# EAGLE design hitchBOT-on-a-board (EAGLE 6.5.0)
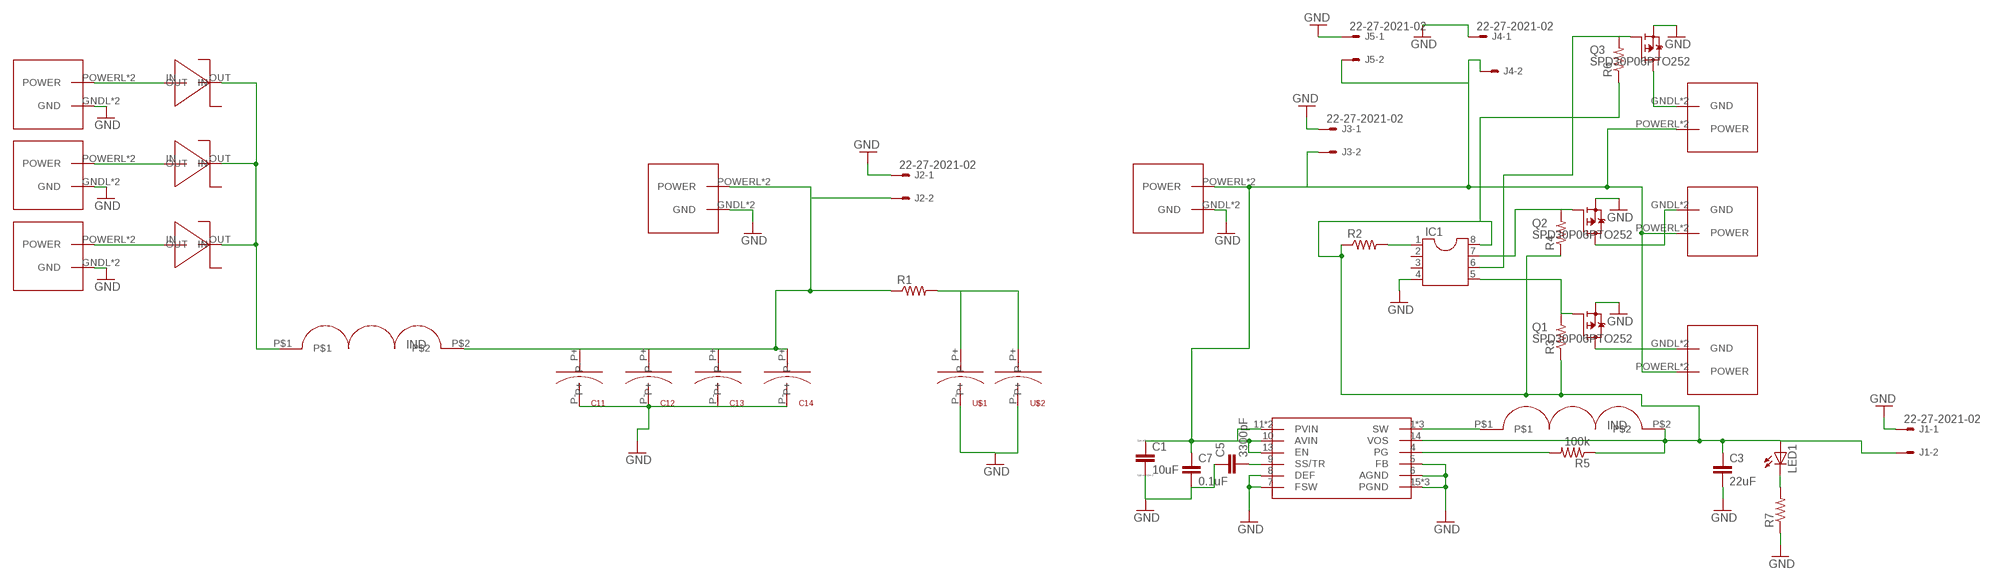
[diagram p0: schematic, sheet 1]

## Parts
C1  10uF  CC1210  [C1210]
C3  22uF  C-EUC0805  [C0805]
C5  3300pF  C-EUC0603  [C0603]
C7  0.1uF  C-EUC0603  [C0603]
C11  SMD-CAP-NICHICON-8MM  [SMD-CAP-8MM]
C12  SMD-CAP-NICHICON-8MM  [SMD-CAP-8MM]
C13  SMD-CAP-NICHICON-8MM  [SMD-CAP-8MM]
C14  SMD-CAP-NICHICON-8MM  [SMD-CAP-8MM]
IC1  DIL8S  [SOCKET-08]
J1  22-27-2021-02  [6410-02]
J2  22-27-2021-02  [6410-02]
J3  22-27-2021-02  [6410-02]
J4  22-27-2021-02  [6410-02]
J5  22-27-2021-02  [6410-02]
LED1  LEDCHIPLED_1206  [CHIPLED_1206]
Q1  SPD30P06PTO252  [TO252]
Q2  SPD30P06PTO252  [TO252]
Q3  SPD30P06PTO252  [TO252]
R1  R-US_R1206  [R1206]
R2  R-US_R1206  [R1206]
R3  R-US_R1206  [R1206]
R4  R-US_R1206  [R1206]
R5  100k  R-US_R1206  [R1206]
R6  R-US_R1206  [R1206]
R7  R-US_R1206  [R1206]
U$1  SMD-CAP-PANASONIC-E-FT-10MM  [SMD-CAP-10MM]
U$2  SMD-CAP-PANASONIC-E-FT-10MM  [SMD-CAP-10MM]
U$3  INDUCTOR-M8365  [INDUCTOR-M8365]
U$4  2X2-MOLEX  [2X2MOLEX]
U$5  2X2-MOLEX  [2X2MOLEX]
U$6  2X2-MOLEX  [2X2MOLEX]
U$7  DO-214AB  [DO-214AB]
U$8  DO-214AB  [DO-214AB]
U$9  DO-214AB  [DO-214AB]
U$10  2X2-MOLEX  [2X2MOLEX]
U$11  2X2-MOLEX  [2X2MOLEX]
U$12  2X2-MOLEX  [2X2MOLEX]
U$13  2X2-MOLEX  [2X2MOLEX]
U$14  TPS62133  [QFN16]
U$15  DR73-2R2-R  [DR73-2R2-R]
U$17  2X2-MOLEX  [2X2MOLEX]

## Nets
GND: C1.2 C3.2 C5.1 C7.2 C11.P- C12.P- C13.P- C14.P- IC1.4 J1.1 J2.1 J3.1 J4.1 J5.1 Q1.2(S) Q2.2(S) Q3.2(S) R7.1 U$1.P- U$2.P- U$4.GNDL(GND) U$4.GNDR(GND) U$5.GNDL(GND) U$5.GNDR(GND) U$6.GNDL(GND) U$6.GNDR(GND) U$10.GNDL(GND) U$10.GNDR(GND) U$11.GNDL(GND) U$11.GNDR(GND) U$14.5(FB) U$14.6(AGND) U$14.7(FSW) U$14.8(DEF) U$14.15(PGND) U$14.16(PGND) U$14.P$1(PGND)
N$1: C11.P+ C12.P+ C13.P+ C14.P+ J2.2 R1.1 U$3.P$2 U$10.POWERL(POWER) U$10.POWERR(POWER)
N$2: R1.2 U$1.P+ U$2.P+
N$3: U$5.POWERL(POWER) U$5.POWERR(POWER) U$7.IN
N$4: U$6.POWERL(POWER) U$6.POWERR(POWER) U$8.IN
N$5: U$4.POWERL(POWER) U$4.POWERR(POWER) U$9.IN
N$6: U$3.P$1 U$7.OUT U$8.OUT U$9.OUT
N$7: IC1.1 R2.2
N$8: C1.1 C7.1 J3.2 J4.2 J5.2 U$11.POWERL(POWER) U$11.POWERR(POWER) U$12.POWERL(POWER) U$12.POWERR(POWER) U$13.POWERL(POWER) U$13.POWERR(POWER) U$14.10(AVIN) U$14.11(PVIN) U$14.12(PVIN) U$14.13(EN) U$17.POWERL(POWER) U$17.POWERR(POWER)
N$9: Q1.3(D) U$13.GNDL(GND) U$13.GNDR(GND)
N$10: Q2.3(D) U$12.GNDL(GND) U$12.GNDR(GND)
N$11: IC1.7 Q2.1(G) R4.2
N$13: IC1.5 Q1.1(G) R3.2
N$14: U$14.1(SW) U$14.2(SW) U$14.3(SW) U$15.P$1
N$15: C3.1 IC1.8 J1.2 LED1.A R2.1 R3.1 R4.1 R5.1 R6.1 U$14.14(VOS) U$15.P$2
N$16: R5.2 U$14.4(PG)
N$17: C5.2 U$14.9(SS/TR)
N$18: Q3.3(D) U$17.GNDL(GND) U$17.GNDR(GND)
N$19: IC1.6 Q3.1(G) R6.2
N$20: LED1.C R7.2
Unconnected: IC1.2 IC1.3

## Library data of the parts
C1 = eagle-ltspice:C: CAPACITOR, European symbol; SPICEMODEL: NONE; SPICEPREFIX: C
C3 C5 C7 = rcl:C-EU: CAPACITOR, European symbol
C11-C14 = macgrid:SMD-CAP-NICHICON-8MM
IC1 = ic-package:DIL8: Dual In Line / Socket
J1-J5 = con-molex:22-?-02: CONNECTOR wire to board 2.54 mm (.1 inch) pitch header; OC_FARNELL: unknown; OC_NEWARK: unknown
LED1 = led:LED: LED OSRAM: - CHIPLED LG R971, LG N971, LY N971, LG Q971, LY Q971, LO R971, LY R971 LH N974, LH R974 LS Q976, LO Q976, LY Q976 LO Q996 - Hyper CHIPLED LW Q18S LB Q993, LB Q99A, LB R99A - SideLED LS A670, LO A670, LY A670, LG A670, LP A670 LB A673, LV A673, LT A673, LW A673 LH A674 LY A675 LS A676, LA A676, LO A676, LY A676, LW A676 LS A679, LY A679, LG A679 - Hyper Micro SIDELED® LS Y876, LA Y876, LO Y876, LY Y876 LT Y87S - SmartLED LW L88C, LW L88S LB L89C, LB L89S, LG L890 LS L89K, LO L89K, LY L89K LS L896, LA L896, LO L896, LY L896 - TOPLED LS T670, LO T670, LY T670, LG T670, LP T670 LSG T670, LSP T670, LSY T670, LOP T670, LYG T670 LG T671, LOG T671, LSG T671 LB T673, LV T673, LT T673, LW T673 LH T674 LS T676, LA T676, LO T676, LY T676, LB T676, LH T676, LSB T676, LW T676 LB T67C, LV T67C, LT T67C, LS T67K, LO T67K, LY T67K, LW E67C LS E67B, LA E67B, LO E67B, LY E67B, LB E67C, LV E67C, LT E67C LW T67C LS T679, LY T679, LG T679 LS T770, LO T770, LY T770, LG T770, LP T770 LB T773, LV T773, LT T773, LW T773 LH T774 LS E675, LA E675, LY E675, LS T675 LS T776, LA T776, LO T776, LY T776, LB T776 LHGB T686 LT T68C, LB T68C - Hyper Mini TOPLED® LB M676 - Mini TOPLED Santana® LG M470 LS M47K, LO M47K, LY M47K Source: http://www.osram.convergy.de LUXEON: - LUMILED® LXK2-PW12-R00, LXK2-PW12-S00, LXK2-PW14-U00, LXK2-PW14-V00 LXK2-PM12-R00, LXK2-PM12-S00, LXK2-PM14-U00 LXK2-PE12-Q00, LXK2-PE12-R00, LXK2-PE12-S00, LXK2-PE14-T00, LXK2-PE14-U00 LXK2-PB12-K00, LXK2-PB12-L00, LXK2-PB12-M00, LXK2-PB14-N00, LXK2-PB14-P00, LXK2-PB14-Q00 LXK2-PR12-L00, LXK2-PR12-M00, LXK2-PR14-Q00, LXK2-PR14-R00 LXK2-PD12-Q00, LXK2-PD12-R00, LXK2-PD12-S00 LXK2-PH12-R00, LXK2-PH12-S00 LXK2-PL12-P00, LXK2-PL12-Q00, LXK2-PL12-R00 Source: www.luxeon.com KINGBRIGHT: KA-3528ASYC Source: www.kingbright.com
Q1-Q3 = transistor-fet:SPD30P06P: SIPMOS(R) Power-Transistor P-Channel, Enhancement mode Source: http://www.infineon.com/upload/Document/cmc_upload/documents/012/3615/SPD_U30P06P.pdf
R1-R6 = resistor:R-US_: RESISTOR, American symbol
R7 = rcl:R-US_: RESISTOR, American symbol
U$1 U$2 = macgrid:SMD-CAP-PANASONIC-E-FT-10MM
U$3 = macgrid:INDUCTOR-M8365
U$4-U$6 U$10-U$13 U$17 = Molex:2X2-MOLEX
U$7-U$9 = macgrid:DO-214AB
U$14 = macgrid:TPS62133
U$15 = macgrid:DR73-2R2-R

## Board
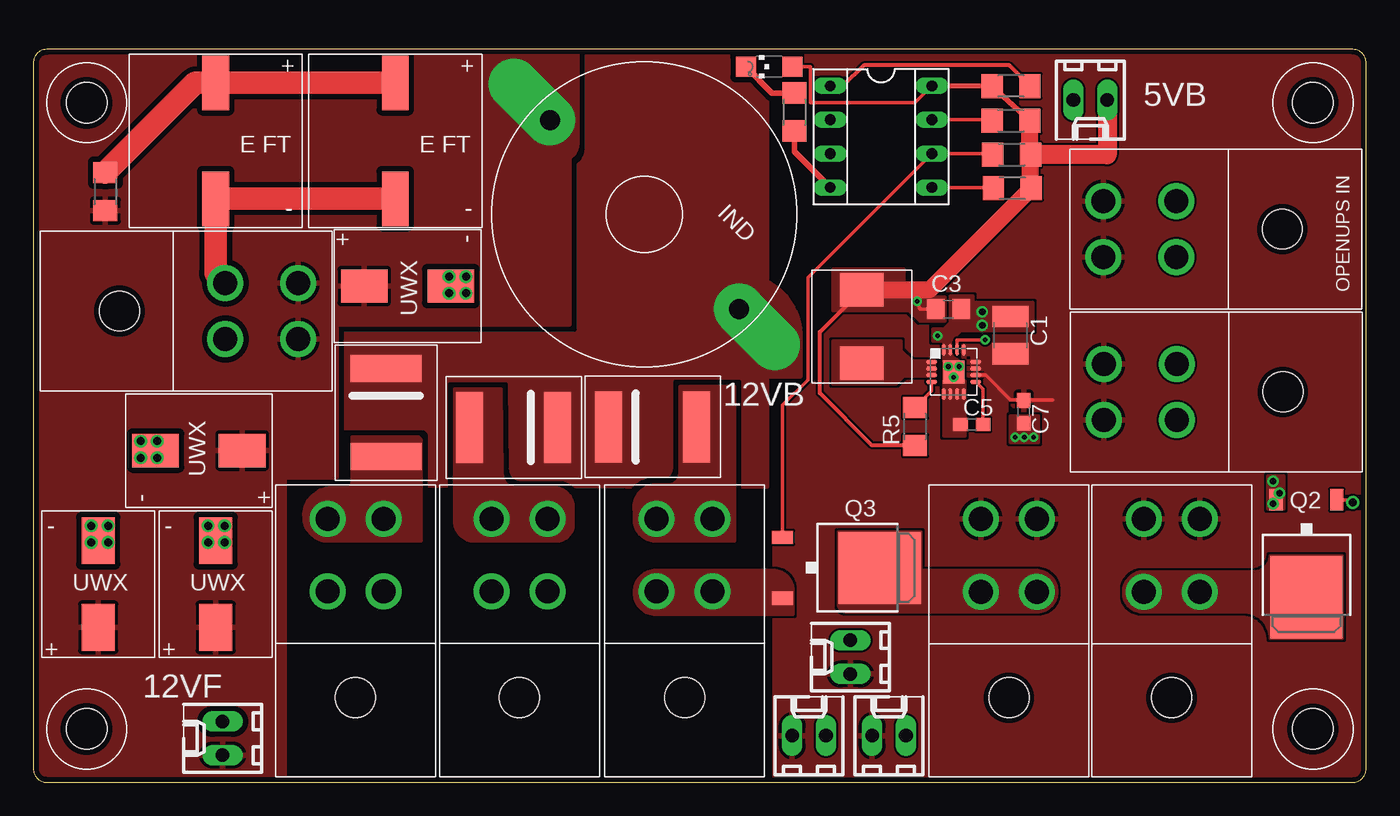
[diagram p1: board, top side]
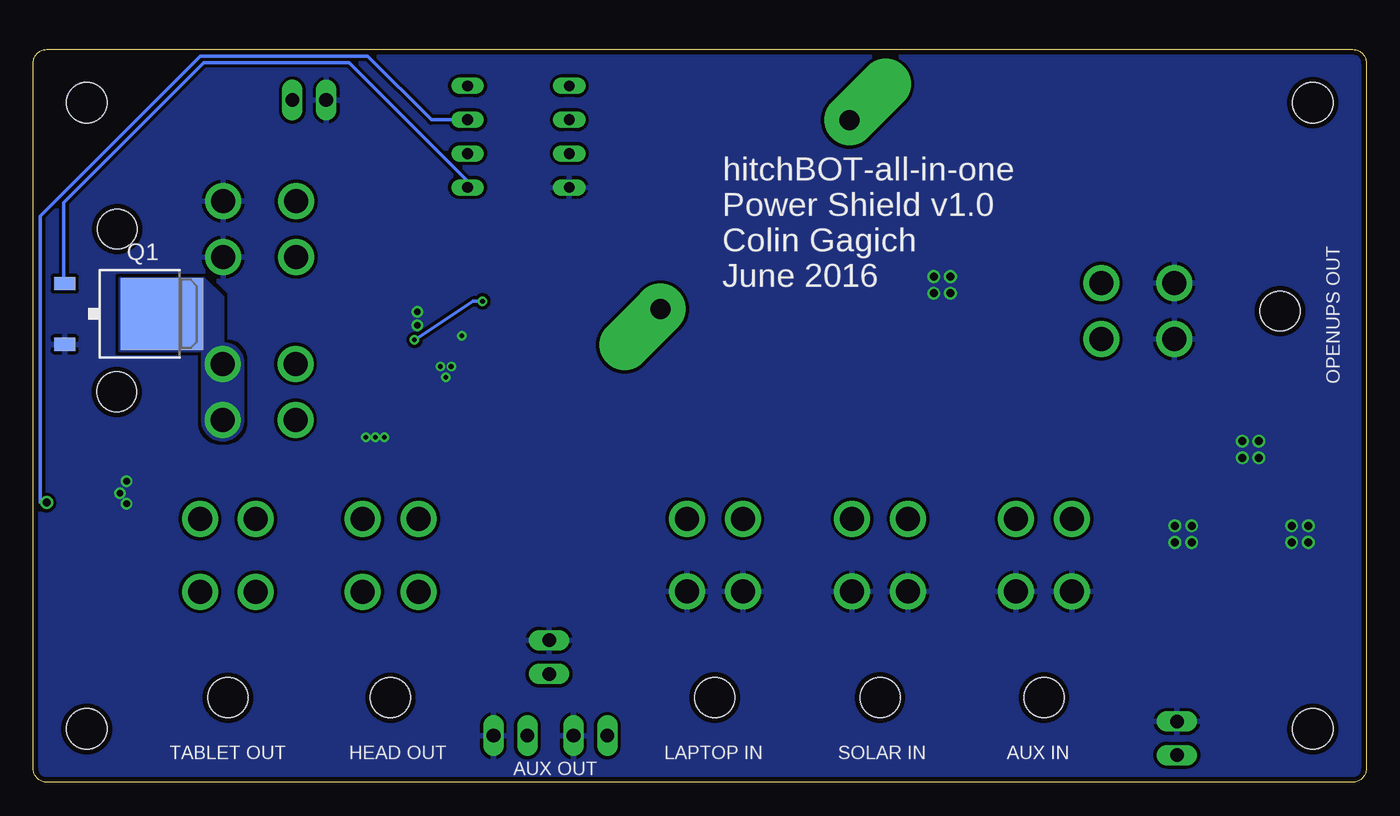
[diagram p2: board, bottom side, seen from below]

Size 100 x 55 mm. Coordinates in mm from the lower left corner, seen from the top.
Outline: 0,54 0,1 arc90 1,0 99,0 arc90 100,1 100,54 arc90 99,55 1,55 arc90 0,54
Copper layers (1*16): Top 0.0356mm / dielectric 1.5011mm / Bottom 0.0356mm
Design rules "LaenPCBOrder": minimum track width 6mil, minimum drill 13mil, track to track 6mil, track to pad 6mil, pad to pad 6mil, via to via 6mil, smd to smd 6mil, copper to edge 15mil, drill to drill 6mil, minimum pad ring 7mil, minimum via ring 7mil, stop-mask expansion 3mil, vias tented up to drill 0mil, thermal gap 10mil
Holes 3.05 mm at 4,4 4,51 96,51 96,4

### Footprints (pad centres in the part's own frame; a part is rotated, then mirrored left to right if it is on the bottom)
C1210 = smd 1.6 x 2.7: 1 -1.4,0; 2 1.4,0
C0805 = smd 1.3 x 1.5: 1 -0.95,0; 2 0.95,0
C0603 = smd 1.1 x 1: 1 -0.85,0; 2 0.85,0
SMD-CAP-8MM = smd 2.5 x 3.5: P+ 0,3.25; P- 0,-3.25
SOCKET-08 = drill 0.813 long: 1 -3.81,-3.81; 2 -1.27,-3.81; 3 1.27,-3.81; 4 3.81,-3.81; 5 3.81,3.81; 6 1.27,3.81; 7 -1.27,3.81; 8 -3.81,3.81
6410-02 = drill 1.016 long: 1 1.27,0; 2 -1.27,0
CHIPLED_1206 = smd 1.5 x 1.5: A 0,-1.75; C 0,1.75
TO252 = smd 1 x 1.6: 1 -2.28,-4.8; 2 2.28,-4.8 | smd 5.4 x 6.2: 3 0,2.5
R1206 = smd 1.6 x 1.803: 1 -1.422,0; 2 1.422,0
SMD-CAP-10MM = smd 2 x 4.1: P+ 0,4.35; P- 0,-4.35
INDUCTOR-M8365 = drill 1.5 pad 3.81 offset: P$1 10.033,0; P$2 -10.033,0
2X2MOLEX = drill 1.8: GNDL -2.1,-2.1; GNDR 2.1,-2.1; POWERL -2.1,3.37; POWERR 2.1,3.37 | hole 3: 0,-10.05
DO-214AB = smd 2.032 x 5.334: IN -3.302,0; OUT 3.302,0
QFN16 = smd 0.85 x 0.3: 1 -1.655,0.75; 2 -1.655,0.25; 3 -1.655,-0.25; 4 -1.655,-0.75; 9 1.655,-0.75; 10 1.655,-0.25; 11 1.655,0.25; 12 1.655,0.75 | smd 0.3 x 0.85: 5 -0.75,-1.655; 6 -0.25,-1.655; 7 0.25,-1.655; 8 0.75,-1.655; 13 0.75,1.655; 14 0.25,1.655; 15 -0.25,1.655; 16 -0.75,1.655 | smd 1.7 x 1.7: P$1 0,0
DR73-2R2-R = smd 2.5 x 3.25: P$1 -2.75,0; P$2 2.75,0

### Placement (x,y rotation side)
C1  73.3,33.55 90 top
C3  68.65,35.5 0 top
C5  70.4,26.85 0 top
C7  74.3,27.8 270 top
C11  12.42,24.89 270 top
C12  13.68,14.88 180 top
C13  28.08,37.24 90 top
C14  4.87,14.88 180 top
IC1  63.6,48.45 270 top
J1  79.3,51.2 180 top
J2  14.2,3.3 90 top
J3  64.2,3.5 0 top
J4  58.2,3.5 0 top
J5  61.3,9.4 90 top
LED1  55.2,53.7 90 top
Q1  92.85,35.15 270 bottom
Q2  95.51,16.4 180 top
Q3  61,16.1 270 top
R1  5.41,44.33 90 top
R2  73.35,52.25 0 top
R3  73.45,44.6 180 top
R4  73.35,49.65 180 top
R5  66.15,26.7 90 top
R6  73.4,47.1 180 top
R7  57.1,50.3 90 top
U$1  13.68,48.14 0 top
U$2  27.15,48.14 0 top
U$3  45.85,42.61 315 top
U$4  36.47,16.41 0 top
U$5  48.87,16.41 0 top
U$6  24.17,16.41 0 top
U$7  46.46,26.67 180 top
U$8  26.47,27.74 90 top
U$9  36.04,26.63 0 top
U$10  16.51,35.36 270 top
U$11  83.66,41.52 90 top
U$12  85.4,16.4 0 top
U$13  83.7,29.3 90 top
U$14  69.05,30.8 0 top
U$15  62.15,34.2 90 top
U$17  73.2,16.4 0 top

### Tracks (layer width: path | path; a pad name or v marks a point on that pad's centre or on a via)
GND  (via drill 0.35 pad 0.25, 0.5, 0.6)
  Top 0.406: v9.3,24.35 9.17,24.48 C11.P- | v31.2,36.7 31.33,36.83 C13.P- | C12.P- 13.55,18 v13.1,18 | v4.35,18 4.48,18.13 C14.P- | IC1.4 57.1,47.33 R7.1
  Top 1.676: U$10.GNDL 13.68,38.19 U$1.P- U$2.P-
  other vias: 69.05,30.4 69.45,31.2 68.65,31.2 67.85,33.5 73.65,25.9 74.35,25.9 75.05,25.9 71.2,35.3 71.2,34.3 4.35,19.25 5.6,19.25 5.6,18 13.1,19.25 14.35,19.25 14.35,18 32.45,36.7 32.45,37.95 31.2,37.95 8.05,24.35 8.05,25.6 9.3,25.6 93,22.6 93.5,21.7 93,20.9
  pour Bottom (isolate 0.254, rank 2): -5,-5 -5,60 105,60 105,-5
  pour Top (no thermals): 69.9,30.1 69.9,26 68.3,26 68.3,30.1
  pour Top (no thermals): 69.4,31.6 68.8,32.2 68.8,33.1 69.6,33.9 75,33.9 75,36 70.5,36 70.5,36.5 68.8,36.5 68.8,34.5 68.3,34 67.5,34 67.5,33.1 68.3,33.1 68.3,31.6
  pour Top (no thermals): 75.4,27.5 75.4,25.5 73.3,25.5 73.3,27.5
  pour Top (no thermals): 57,14.4 57,12.6 46.7,12.6 arc-90 45.1,14.2 45.1,14.3 arc-90 46.7,15.9 55.5,15.9 arc-90
  pour Top (no thermals): 92.6,20.5 92.6,23 93.8,23 93.8,20.5
N$1
  pour Top (isolate 0.406): -5,-5 -5,60 40.2,60 40.2,34.4 22.7,34.4 22.7,22.9 18.8,22.9 18.8,-4.9
  pour Top (no thermals): 33.35,54.75 33.35,47.92 arc90 34.62,46.65 39.58,46.65 arc90 40.85,47.92 40.85,54.65
N$2
  Top 1.676: R1.2 12.15,52.49 U$1.P+ U$2.P+
N$3
  pour Top (no thermals): 48.5,29.7 52.6,29.7 52.6,18.1 46.8,18.1 arc-90 45.1,19.6 45.1,20.33 arc-90 46.47,22.3 47.7,22.3 arc90 48.5,23.3
N$4
  pour Top (no thermals): 23.9,25.9 28.75,25.9 arc-90 29.1,25.65 29.1,18.1 22.3,18.1 arc-90 20.3,19.8 20.3,19.9 arc-90 22.3,22.1 23.65,22.1 arc90 23.9,22.35
N$5
  pour Top (no thermals): 31.6,29.5 35.1,29.5 35.19,23.09 arc89 36.19,22.1 39.23,22.1 arc-90 40.5,20.43 40.5,19.37 arc-90 39.23,18.1 33.1,18.1 arc-90 31.6,19.6
N$6
  pour Top (isolate 0.406, rank 2, no thermals): 23.3,33.6 40.9,33.6 40.9,55.85 55,56 55,22.2 23.3,22.3
  pour Top (no thermals): 50.25,38 53.25,38 arc-90 57.5,33.25 57.5,30.5 54.5,30.5 arc-121
N$7
  Top 0.305: R2.2 73.22,53.8 62.3,53.8 60.76,52.26 IC1.1
N$8
  Top 0.254: U$14.10 71.45,30.55 73.3,28.7 74.35,28.7 | 76.5,28.7 74.35,28.7 | 74.35,28.7 C7.1
  pour Top (rank 6): 55.65,56 101,56 101,-1.5 55.65,-1.5
  pour Top (no thermals): 70.4,31 72.1,31 73.1,30 74.9,30 74.9,33.1 69.8,33.1 69.8,32.1 70.4,32.1
N$9
  pour Bottom (no thermals): 93.5,37.8 93.5,32.4 87.3,32.4 87.3,27.2 arc-90 85.8,25.7 arc-90 84.3,27.2 84.3,31.5 arc-94 85.8,32.9 85.8,36.4 87.2,37.8
N$10
  pour Top (no thermals): 98.2,17 98.2,10.8 92.8,10.8 arc90 90.8,12.8 83.2,12.8 arc-90 81.8,14.2 81.8,14.3 arc-90 83.3,15.8 87.5,15.8 91.6,15.8 arc90 92.8,17
N$11  (via drill 0.6)
  Top 0.254: v99,21 99,21.2 Q2.1 | 71.86,49.72 IC1.7
  Top 0.305: R4.2 71.86,49.72
  Bottom 0.254: IC1.7 70.12,49.72 74.9,54.5 87.5,54.5 99.5,42.5 99.5,21 v99,21
N$12
  pour Top: 70.4,30.5 71.2,30.5 73.7,28 74.9,28 74.9,29.2 73.7,29.2 73.7,28.7 71.8,30.6 70.4,30.6
N$13
  Top 0.254: 71.99,44.64 IC1.5
  Top 0.305: R3.2 71.99,44.64
  Bottom 0.254: IC1.5 67.41,45.11 76.3,54 87.2,54 97.7,43.5 97.7,37.48 Q1.1
N$14
  pour Top (no thermals): 67.6,30.5 65.3,30.5 64.7,29.9 60,29.9 60,33.1 65.1,33.1 65.1,32.4 65.9,31.6 67.6,31.6
N$15  (via drill 0.35, 0.35 pad 0.25)
  Top 0.254: C3.1 66.5,35.5 v66.3,36.1 | U$14.14 69.3,33.2 v71.4,33.2 | IC1.8 66.15,51 58.3,51 58.3,53.7 LED1.A
  Top 0.305: R5.1 62.92,25.28 59,29.2 59,33.8 U$15.P$2 62.15,37.25 62.9,38 | R3.1 74.82,44.65 | R6.1 74.77,47.15
  Top 0.406: R4.1 R2.1 IC1.8
  Top 1.27: 74.82,44.65 R6.1 | 74.77,47.15 R4.1 | R3.1 67.22,36.95 U$15.P$2
  Top 1.422: J1.2 80.57,47.1 R6.1
  Bottom 0.254: v66.3,36.1 67,36.1 v71.4,33.2
  pour Top (no thermals): 68.4,34.6 66.5,34.6 65.7,35.4 60,35.4 60,38.5 65.3,38.5 65.3,37.1 65.8,37.1 66.5,36.4 68.4,36.4
N$16
  Top 0.254: U$14.4 67.39,29.37 R5.2
N$17
  Top 0.254: U$14.9 71.25,29.5 C5.2
N$18
  pour Top (no thermals): 60.4,13.4 60.4,18.8 66.6,18.8 66.6,15.9 71.1,15.9 75.2,15.9 arc-90 76.8,14.3 arc-90 75.3,12.8 71.1,12.8 61,12.8 arc-90
N$19
  Top 0.254: 71.9,47.18 IC1.6 58.1,37.87 58.1,30.2 56.2,28.3 Q3.1
  Top 0.305: R6.2 71.9,47.18
N$20
  Top 0.406: R7.2 55.43,51.72 LED1.C

### Text on the board
tPlace: 5VB | OPENUPS IN | 12VB | 12VF
bPlace: OPENUPS OUT | hitchBOT-all-in-one / Power Shield v1.0 / Colin Gagich / June 2016 | AUX IN | SOLAR IN | LAPTOP IN | HEAD OUT | TABLET OUT | AUX OUT